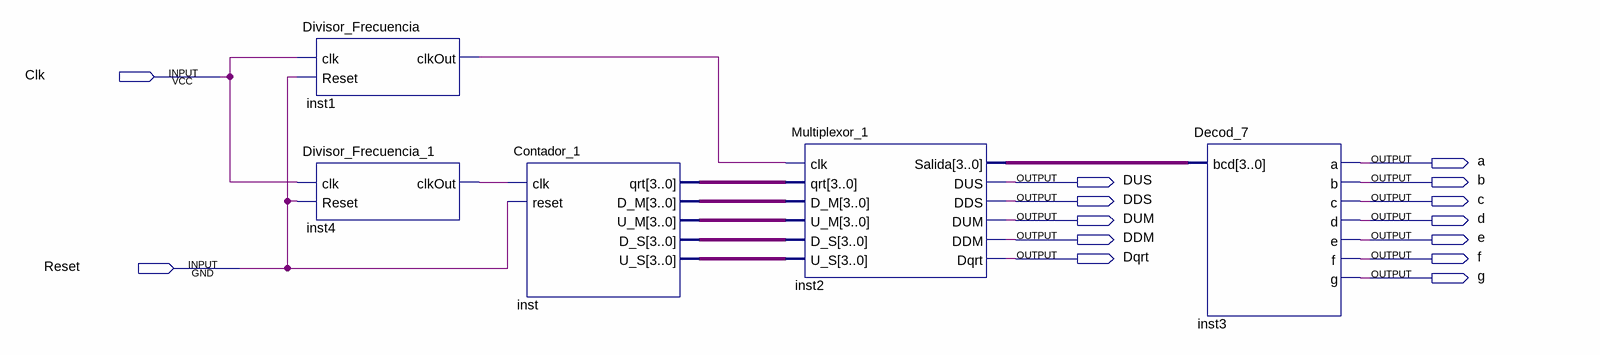
[diagram p0: schematic sheet]
// Quartus schematic Proyecto.bdf as structural Verilog: 5 symbols, 14 pins
module Proyecto (
  input  Clk,
  input  Reset,
  output a,
  output DUS,
  output b,
  output DDS,
  output c,
  output DUM,
  output d,
  output DDM,
  output e,
  output Dqrt,
  output f,
  output g
);

  wire inst1_clkout, inst4_clkout;
  wire [3:0] inst2_salida, inst_d_m, inst_d_s, inst_qrt, inst_u_m, inst_u_s;

  Divisor_Frecuencia inst1 (.clk(Clk), .Reset(Reset), .clkOut(inst1_clkout));
  Divisor_Frecuencia_1 inst4 (.clk(Clk), .Reset(Reset), .clkOut(inst4_clkout));
  Contador_1 inst (
    .clk(inst4_clkout), .reset(Reset), .qrt(inst_qrt), .D_M(inst_d_m), .U_M(inst_u_m), .D_S(inst_d_s),
    .U_S(inst_u_s));
  Multiplexor_1 inst2 (
    .clk(inst1_clkout), .qrt(inst_qrt), .D_M(inst_d_m), .U_M(inst_u_m), .D_S(inst_d_s), .U_S(inst_u_s),
    .Salida(inst2_salida), .DUS(DUS), .DDS(DDS), .DUM(DUM), .DDM(DDM), .Dqrt(Dqrt));
  Decod_7 inst3 (.bcd(inst2_salida), .a(a), .b(b), .c(c), .d(d), .e(e), .f(f), .g(g));
endmodule
